# Altium schematic sheet UTHP J1708 LIN RTC.SchDoc: Ultimate Truck Hacking Platform
size Letter; Author: Systems Cyber Research Group; Address1: Jeremy Daily; Address2: Thomas Balzer; Address3: Carson Green; Address4: Fort Collins, CO; DocumentNumber: I2C and J1708; Revision: 1; SheetNumber: 6; SheetTotal: 6; ENG_APP_DATE: --/--/--; DSN_APP_DATE: --/--/--; CHK_APP_DATE: --/--/--
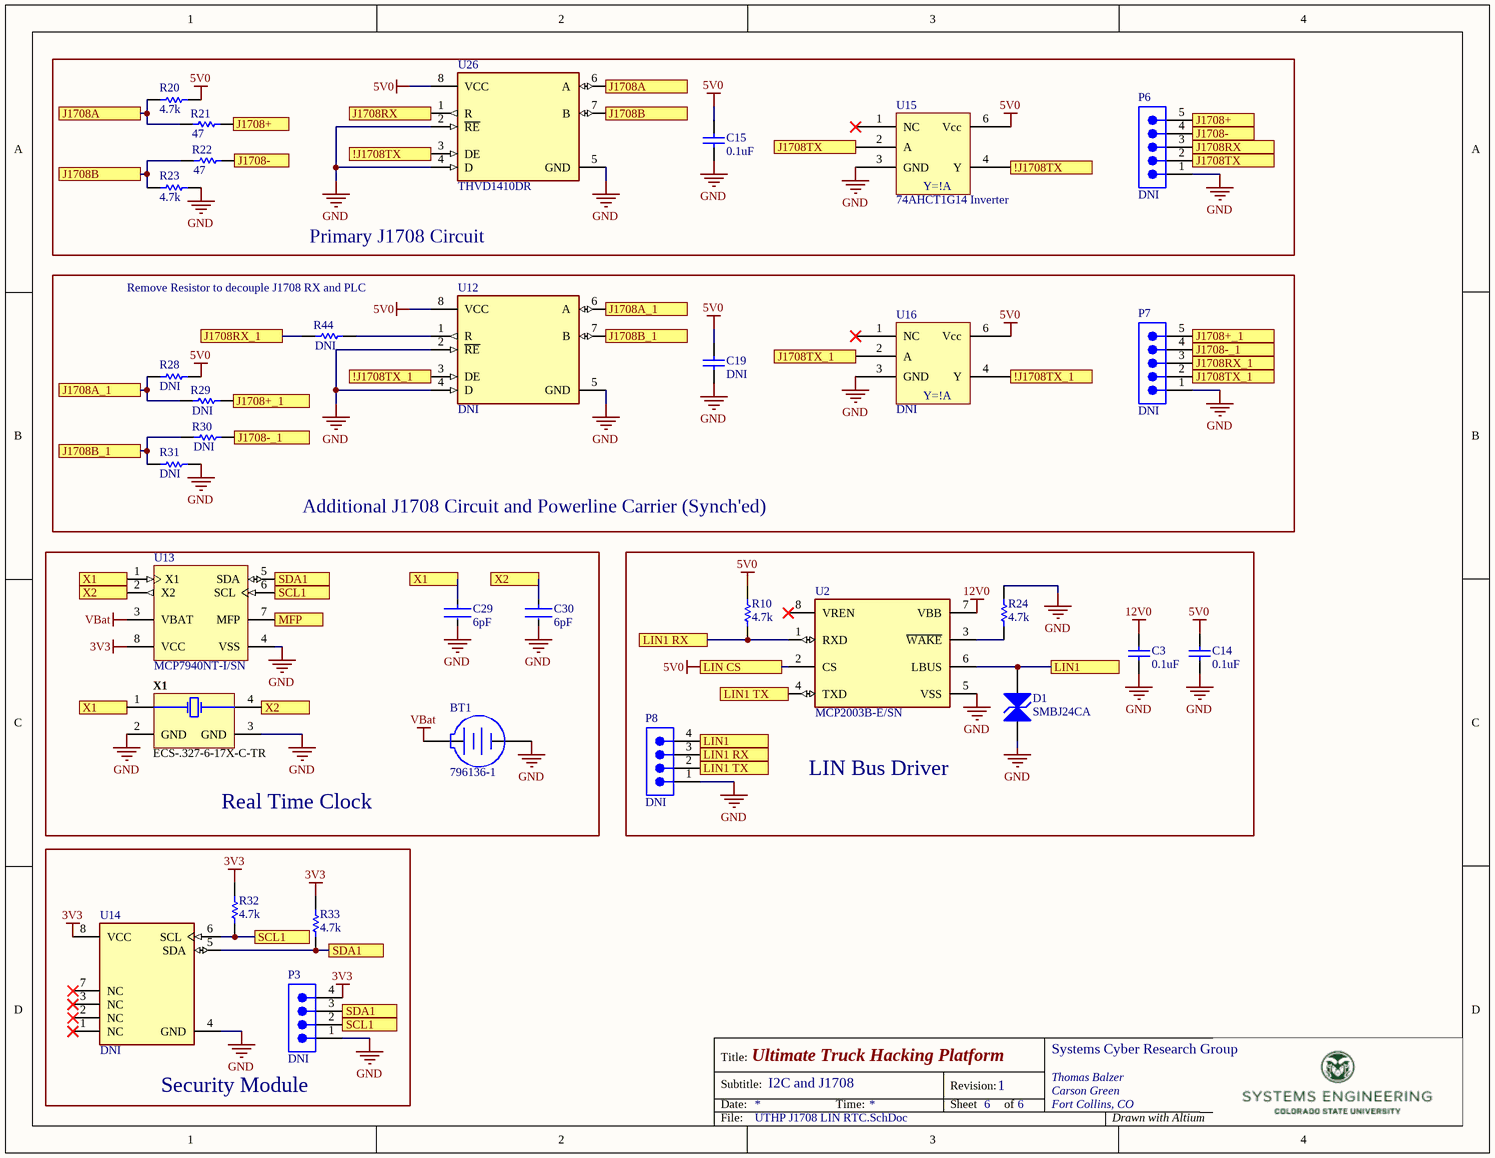
[diagram p0: UTHP J1708 LIN RTC.SchDoc]

## Parts
BT1  796136-1  [TECO-796136-1_V]
C3  0.1uF  [CAPC1608X90X35LL15T15]
C14  0.1uF  [CAPC1608X90X35LL15T15]
C15  0.1uF  [CAPC1608X90X35LL15T15]
C19  DNI  [CAPC1608X90X35LL15T15]
C29  6pF  [FP-CGA3E-0_3-0_1-MFG]
C30  6pF  [FP-CGA3E-0_3-0_1-MFG]
D1  SMBJ24CA  [VISH-DO-214AA-A-2_V]
P3  DNI  [61300411121]
P6  DNI  [61300511121]
P7  DNI  [61300511121]
P8  DNI  [61300411121]
R10  4.7k  [RESC1608X55X30NL15T15]
R20  4.7k  [RESC1608X55X30NL15T15]
R21  47  [RESC1609X50X30LL10T20]
R22  47  [RESC1609X50X30LL10T20]
R23  4.7k  [RESC1608X55X30NL15T15]
R24  4.7k  [RESC1608X55X30NL15T15]
R28  DNI  [RESC1608X55X30NL15T15]
R29  DNI  [RESC1609X50X30LL10T20]
R30  DNI  [RESC1609X50X30LL10T20]
R31  DNI  [RESC1608X55X30NL15T15]
R32  4.7k  [RESC1608X55X30NL15T15]
R33  4.7k  [RESC1608X55X30NL15T15]
R44  DNI  [RESC1609X50X30LL10T20]
U2  MCP2003B-E/SN  [FP-C04-057-IPC_B]
U12  DNI  [FP-D0008A-IPC_B]
U13  MCP7940NT-I/SN  [SOIC-SN8_M]
U14  DNI  [FP-C04-057-OA-MFG]
U15  74AHCT1G14 Inverter  [SOT-353]
U16  DNI  [SOT-353]
U26  THVD1410DR  [FP-D0008A-IPC_B]
X1  ECS-.327-6-17X-C-TR  [ECS-.327-6-17X-C-TR-Footprint-1]

## Blocks framed on the sheet
Primary J1708 Circuit: C15 P6 R20-R23 U15 U26
Additional J1708 Circuit and Powerline Carrier (Synch'ed): C19 P7 R28-R31 R44 U12 U16
Real Time Clock: BT1 C29 C30 U13 X1
LIN Bus Driver: C3 C14 D1 P8 R10 R24 U2
Security Module: P3 R32 R33 U14

## Ports
!J1708TX, !J1708TX_1, J1708+, J1708+_1, J1708-, J1708-_1, J1708A, J1708A_1, J1708B, J1708B_1, J1708RX, J1708RX_1, J1708TX, J1708TX_1, LIN1, LIN1 RX, LIN1 TX, LIN CS, MFP, SCL1, SDA1, X1, X2

## Nets
3V3: P3.4 R32.1 R33.1 U13.8(VCC) U14.8(VCC)
5V0: C14.1 C15.1 C19.1 R10.2 R20.1 R28.1 U2.2(CS) U12.8(VCC) U15.6(Vcc) U16.6(Vcc) U26.8(VCC) ; port LIN CS
12V0: C3.1 U2.7(VBB)
GND: BT1.2(-) C3.2 C14.2 C15.2 C19.2 C29.2 C30.2 D1.1(A) P3.1 P6.1 P7.1 P8.1 R23.1 R24.2 R31.1 U2.5(VSS) U12.2(~{RE}) U12.4(D) U12.5(GND) U13.4(VSS) U14.4(GND) U15.3(GND) U16.3(GND) U26.2(~{RE}) U26.4(D) U26.5(GND) X1.2(GND) X1.3(GND)
VBat: BT1.1(+) U13.3(VBAT)
!J1708TX: U15.4(Y) U26.3(DE) ; port !J1708TX
!J1708TX_1: U12.3(DE) U16.4(Y) ; port !J1708TX_1
J1708+: P6.5 R21.2 ; port J1708+
J1708+_1: P7.5 R29.2 ; port J1708+_1
J1708-: P6.4 R22.2 ; port J1708-
J1708-_1: P7.4 R30.2 ; port J1708-_1
J1708A: R20.2 R21.1 U26.6(A) ; port J1708A
J1708A_1: R28.2 R29.1 U12.6(A) ; port J1708A_1
J1708B: R22.1 R23.2 U26.7(B) ; port J1708B
J1708B_1: R30.1 R31.2 U12.7(B) ; port J1708B_1
J1708RX: P6.3 U26.1(R) ; port J1708RX
J1708RX_1: P7.3 R44.1 ; port J1708RX_1
J1708TX: P6.2 U15.2(A) ; port J1708TX
J1708TX_1: P7.2 U16.2(A) ; port J1708TX_1
LIN1: D1.2(A) P8.4 U2.6(LBUS) ; port LIN1
LIN1 RX: P8.3 R10.1 U2.1(RXD) ; port LIN1 RX
LIN1 TX: P8.2 U2.4(TXD) ; port LIN1 TX
MFP: U13.7(MFP) ; port MFP
SCL1: P3.2 R32.2 U13.6(SCL) U14.6(SCL) ; port SCL1
SDA1: P3.3 R33.2 U13.5(SDA) U14.5(SDA) ; port SDA1
X1: C29.1 U13.1(X1) X1.1(X1) ; port X1
X2: C30.1 U13.2(X2) X1.4(X2) ; port X2
NetR24_1: R24.1 U2.3(~{WAKE})
NetR44_2: R44.2 U12.1(R)

Not connected (* = marked no-connect by the designer): U2 8(VREN)*; U14 1(NC)* 2(NC)* 3(NC)* 7(NC)*; U15 1(NC)*; U16 1(NC)*

## Notes on the sheet
- (near R44) Remove Resistor to decouple J1708 RX and PLC
- Title:
- Subtitle:
- Date:
- Time:
- Revision:
- Sheet
- of
- File:
- Drawn with Altium
- (in symbol CMP-023-000006-1) Y=!A

## Library data of the parts
BT1 = CMP-002-00002-2: Battery Connector, 1 Cell, CR2032, 2-Pin SMD, RoHS, Tape and Reel; Manufacturer: TE Connectivity; Max Voltage Rating (AC): 30V; Connector Type: BatteryHolder; Batteries: 1; Datasheet URL: http://www.te.com/commerce/DocumentDelivery/DDEController?Action=srchrtrv&DocNm=796136&DocType=Customer+Drawing&DocLang=English&DocFormat=pdf&PartCntxt=796136-1; Contact Plating: Tin; Case/Package: 796136-1; Colour: Black; Package Reference: 796136-1; Package Quantity: 400; Pins: 2; Mounting Technology: SM; RoHS Compliant: True; Datasheet Version: Dec-13; Package Description: 2-Pin Surface Mount Device, Body 32.31 x 19.05 mm; Packaging: TapeandReel; Manufacturer URL: http://www.te.com/; Contact Material: Bronze
C3 C14 C15 = CMP-2006-04387-1: 0.1 µF ±10% 50V Ceramic Capacitor X7R 0603 (1608 Metric); Manufacturer: KYOCERA AVX; Part Number: KAM15AR71H104KM; Supplier 1: Digi-Key; Supplier Part Number 1: 478-KAM15AR71H104KMTR-ND; Value: 0.1uF
C19 = CMP-2006-04387-1: 0.1 µF ±10% 50V Ceramic Capacitor X7R 0603 (1608 Metric); Manufacturer: KYOCERA AVX; Part Number: KAM15AR71H104KM; Value: 0.1uF; Supplier 1: Digi-Key; Supplier Part Number 1: 478-KAM15AR71H104KMTR-ND
C29 C30 = CMP-08246-001317-1: Cap Ceramic 6pF 50V C0G 0.5pF Pad SMD 0603 +125°C Automotive T/R CGA3E2C0G1H060D080AA; Manufacturer: TDK Corporation; Part Number: CGA3E2C0G1H060D080AA; Supplier 1: Digi-Key; Supplier Part Number 1: 445-5623-1-ND; Value: 6pF
D1 = CMP-2000-07094-1: TRANSZORB(R) Transient Voltage Suppressor, 24 V, -55 to 150 degC, 2-Pin DO-214AA (SMBJ), RoHS, Tape and Reel; Manufacturer: Vishay; Part Number: SMBJ24CA-E3/52; Value: TVS Diode; Supplier 1: Digi-Key; Supplier Part Number 1: SMBJ24CA-E3/52GICT-ND
P3 = CMP-1502-01064-2
P6 P7 = CMP-1502-01068-2: NexarPartId: 32855526; Operating Supply Voltage: 250V; Number of Contacts: 5; Connector Type: Male Pin; Current Rating: 3A; Contact Resistance: 20mΩ; Pitch: 2.54mm; Gender: Male; Termination: Solder; RoHS: Compliant; Lead Pitch: 2.54mm; Contact Mating Length: 5.9944mm; Number of Positions: 5; Lead Free: Lead Free; Contact Plating: Gold; Number of Pins: 5; Min Operating Temperature: -40°C; Voltage Rating: 250V; Color: Black; Mount: Through Hole; REACH SVHC: Unknown; Packaging: Bulk; Height: 8.89mm; Number of Rows: 1; Orientation: Vertical; Contact Material: Copper; Max Operating Temperature: 105°C
P8 = CMP-1502-01064-2: NexarPartId: 32855522; Pitch: 2.54mm; Number of Contacts: 4; Contact Resistance: 20mΩ; Gender: Male; Current Rating: 3A; Connector Type: Male Pin; Voltage Rating: 250V; Lead Free: Lead Free; Contact Plating: Gold; Max Operating Temperature: 105°C; Packaging: Bulk; Height: 8.89mm; Orientation: Vertical; Contact Mating Length: 5.9944mm; Contact Material: Copper; Lead Pitch: 2.54mm; Min Operating Temperature: -40°C; Termination: Solder; Color: Black; Number of Rows: 1; REACH SVHC: Unknown; RoHS: Compliant; Mount: Through Hole; Number of Positions: 4; Number of Pins: 4; Operating Supply Voltage: 250V
R10 R20 R23 R24 R32 R33 = CMP-1012-00586-3: 4.7 kOhms ±1% 0.1W, 1/10W Chip Resistor 0603 (1608 Metric) Automotive AEC-Q200 Thick Film; Manufacturer: Panasonic Electronic Components; Part Number: ERJ-3EKF4701V; Supplier 1: Digi-Key; Supplier Part Number 1: P4.70KHCT-ND; Value: 4.7k
R21 R22 = CMP-2000-03383-1: CRCW060347R0FKEA Res Thick Film 0603 47 Ohm 1% 1/10W ±100ppm/°C Molded SMD Paper T/R; Manufacturer: Vishay Dale; Part Number: CRCW060347R0FKEA; Supplier 1: Digi-Key; Supplier Part Number 1: 541-47.0HCT-ND; Value: 47
R28 R31 = CMP-1012-00586-3: 4.7 kOhms ±1% 0.1W, 1/10W Chip Resistor 0603 (1608 Metric) Automotive AEC-Q200 Thick Film; Manufacturer: Panasonic Electronic Components; Part Number: ERJ-3EKF4701V; Value: 4.7k; Supplier 1: Digi-Key; Supplier Part Number 1: P4.70KHCT-ND
R29 R30 R44 = CMP-2000-03383-1: CRCW060347R0FKEA Res Thick Film 0603 47 Ohm 1% 1/10W ±100ppm/°C Molded SMD Paper T/R; Manufacturer: Vishay Dale; Value: 47; Part Number: CRCW060347R0FKEA; Supplier 1: Digi-Key; Supplier Part Number 1: 541-47.0HCT-ND
U2 = CMP-06279-000013-1: IC TRANSCEIVER HALF 1/1 8SOIC
U12 = CMP-04875-000079-1: 1/1 Transceiver Half RS485 8-SOIC; Manufacturer: Texas Instruments; Part Number: THVD1410DR; Value: Half-Duplex Transcieiver; Supplier 1: Digi-Key; Supplier Part Number 1: 296-THVD1410DRCT-ND
U13 = CMP-0186-00194-1: Real Time Clock (RTC) IC Clock/Calendar 64B I²C, 2-Wire Serial 8-SOIC (0.154", 3.90mm Width); Manufacturer: Microchip; Part Number: MCP7940NT-I/SN; Supplier 1: Digi-Key; Supplier Part Number 1: MCP7940NT-I/SNCT-ND; Value: RTC
U14 = CMP-06260-000004-1: Authentication Chip 8-SOIC\; Manufacturer: Microchip; Part Number: ATECC608A-SSHDA-B; Value: Security Module; Supplier 1: Digi-Key; Supplier Part Number 1: ATECC608A-SSHDA-B-ND
U15 U16 = CMP-023-000006-1: Single Schmidt Trigger Inverter
U26 = CMP-04875-000079-1: 1/1 Transceiver Half RS485 8-SOIC; Manufacturer: Texas Instruments; Value: Half-Duplex Transcieiver; Part Number: THVD1410DR; Supplier 1: Digi-Key; Supplier Part Number 1: 296-THVD1410DRCT-ND
X1 = CMP-003-00030-1: ECX306X Series 32.76 kHz ±10 ppm 6 pF -40 to +85 °C Surface Mount Crystal